# Altium schematic sheet Circuit Capteur Luminosité.SchDoc
size 127 x 101 mm
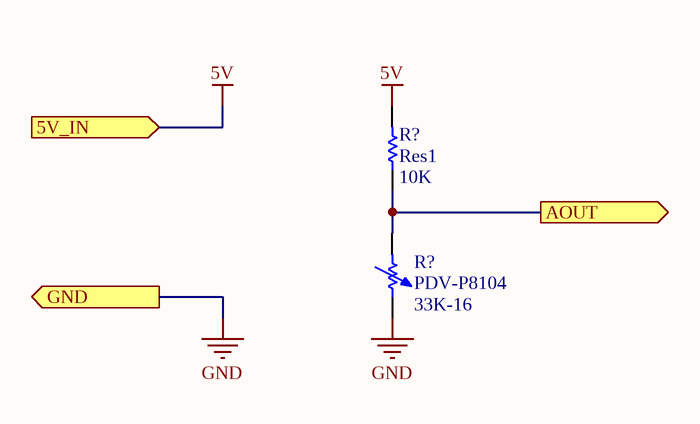
[diagram p0: Circuit Capteur Luminosité.SchDoc]

## Parts
(Parts that share a designator on the sheet are numbered #1, #2 ... from top to bottom, then left to right.)
R?#1  Res1  value 10K  [AXIAL-0.3]
R?#2  PDV-P8104  value 33K-16  [AXIAL-0.7]

## Ports
5V_IN (in), AOUT (out), GND (out)

## Nets
5V: R?#1.2 ; port 5V_IN
GND: R?#2.2 ; port GND
AOUT: R?#1.1 R?#2.1 ; port AOUT

## Library data of the parts
R?#1 = Res1: Resistor; Published: 8-Jun-2000; LatestRevisionDate: 17-Jul-2002; LatestRevisionNote: Re-released for DXP Platform.; PackageReference: AXIAL-0.3; Publisher: Altium Limited; PackageDescription: Axial Device, Thru-Hole; 2 Leads; 0.3 in Pin Spacing
R?#2 = Res Adj1: Variable Resistor; Set Position: 0.5; Published: 8-Jun-2000; LatestRevisionDate: 17-Jul-2002; LatestRevisionNote: Re-released for DXP Platform.; PackageReference: AXIAL-0.7; Publisher: Altium Limited; PackageDescription: Axial Device, Thru-Hole; 2 Leads; 0.7 in Pin Spacing